# EAGLE board tf330 (EAGLE 9.5.2), part 1 of 2
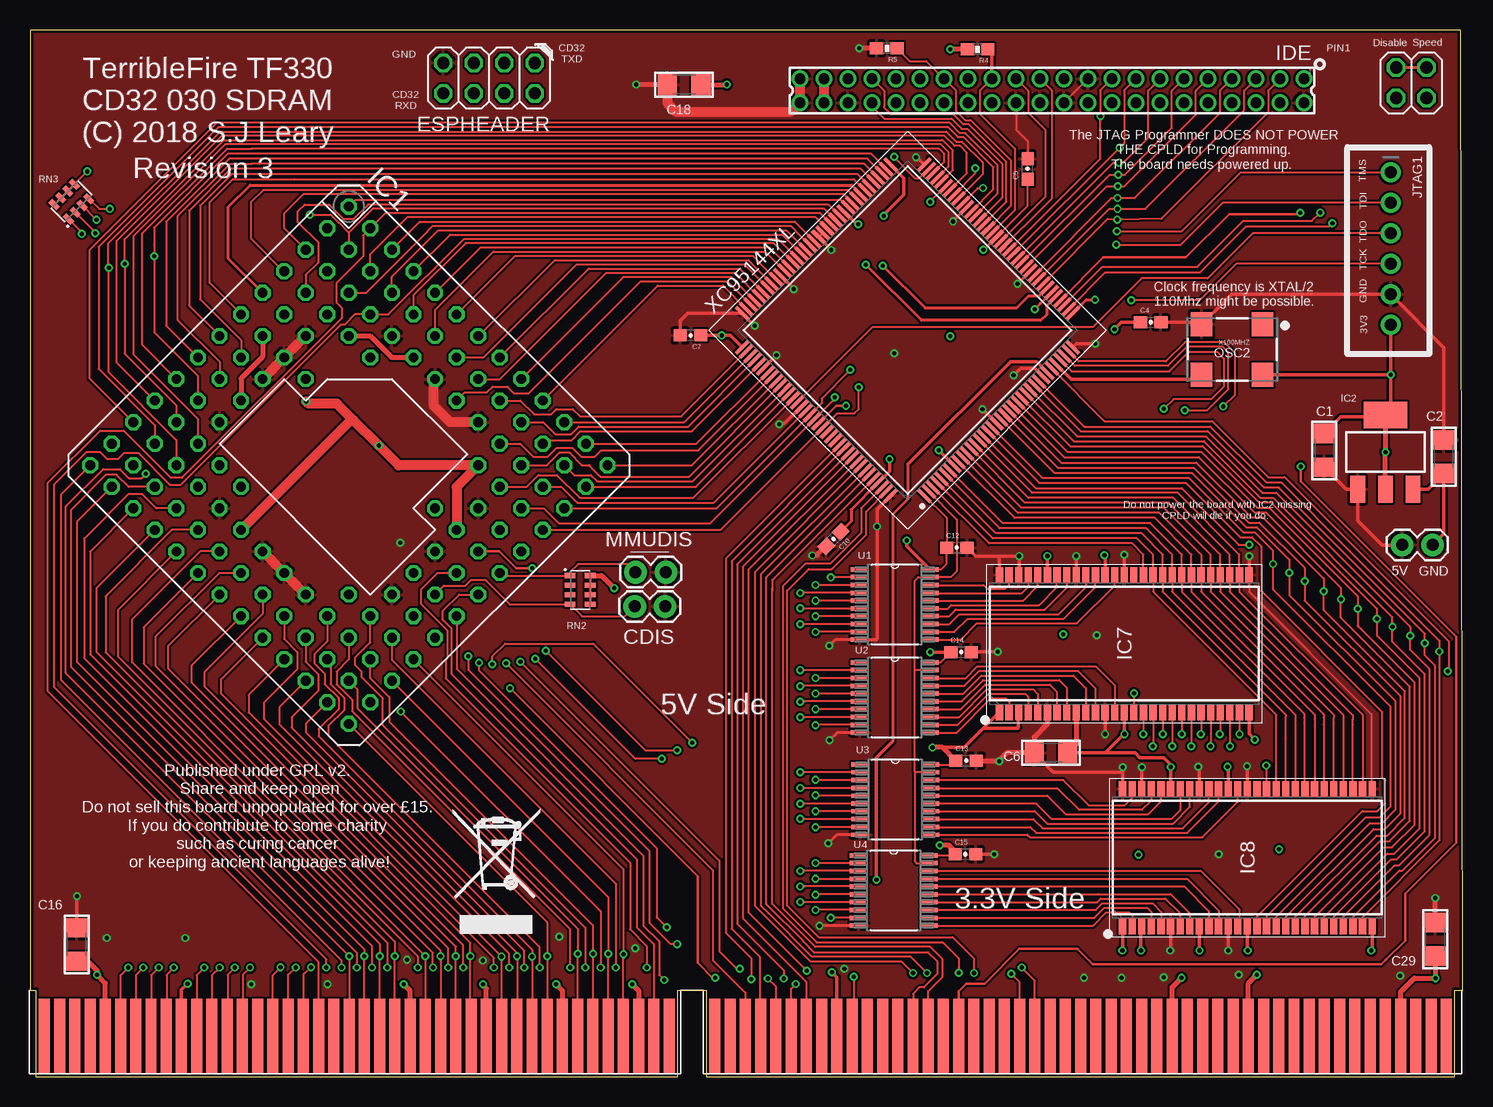
[diagram p4: board, top side]
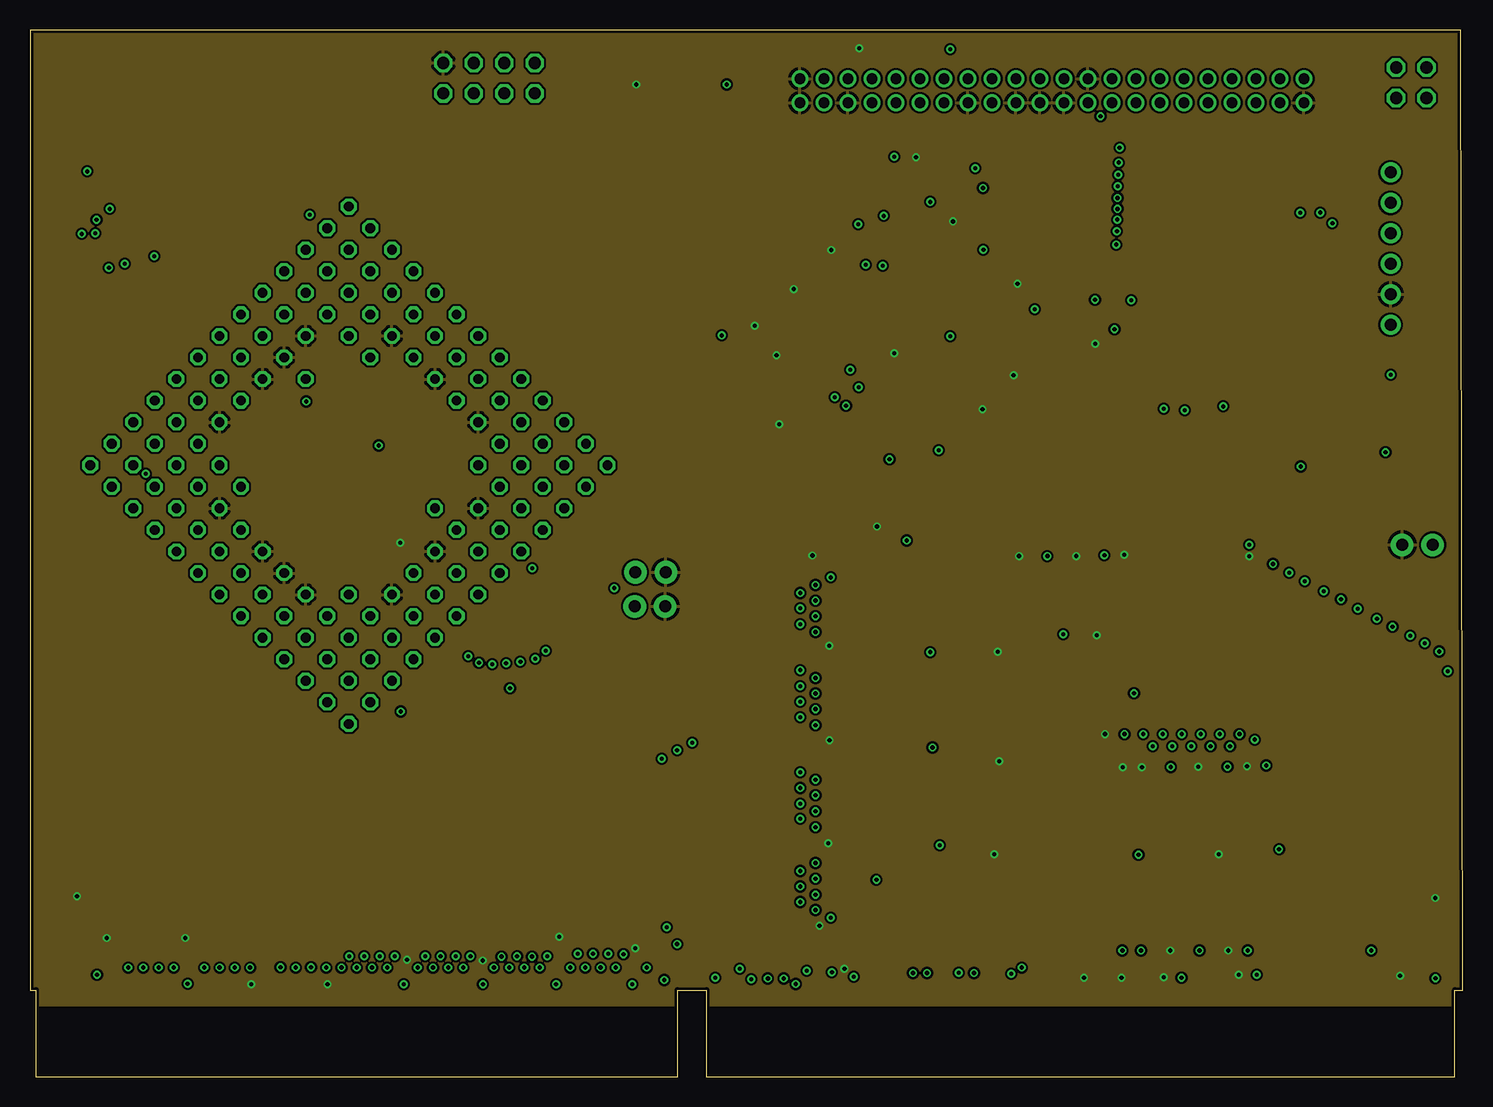
[diagram p5: board, inner layer GND]
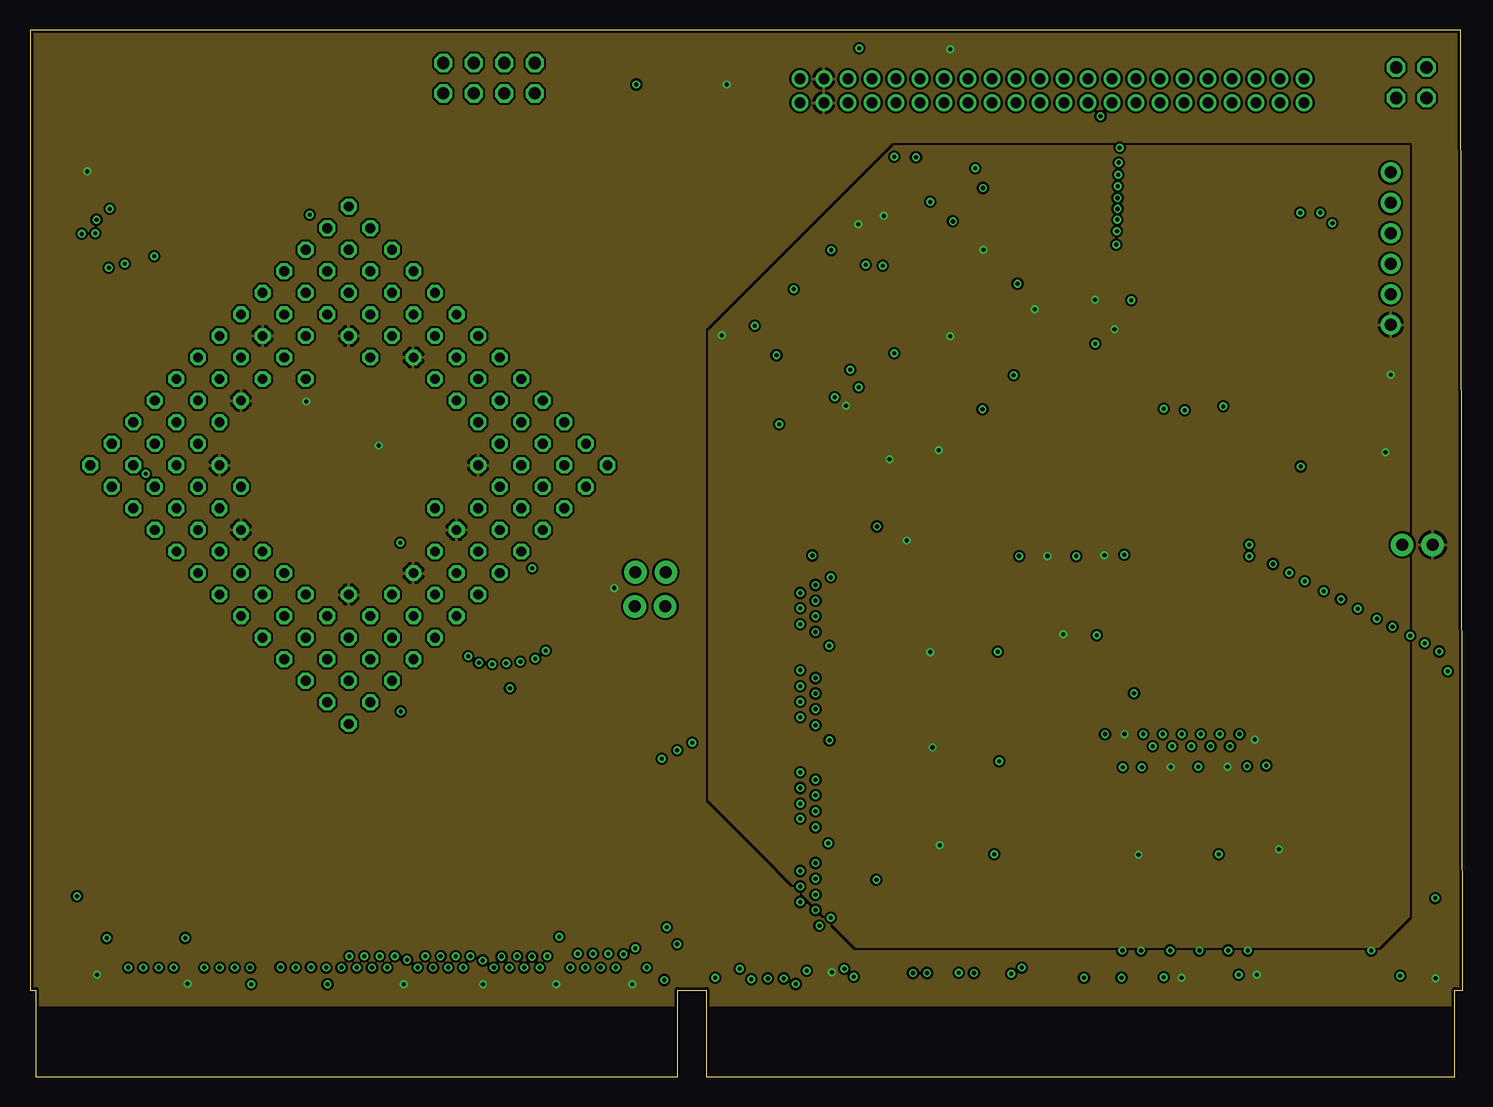
[diagram p6: board, inner layer PWR]
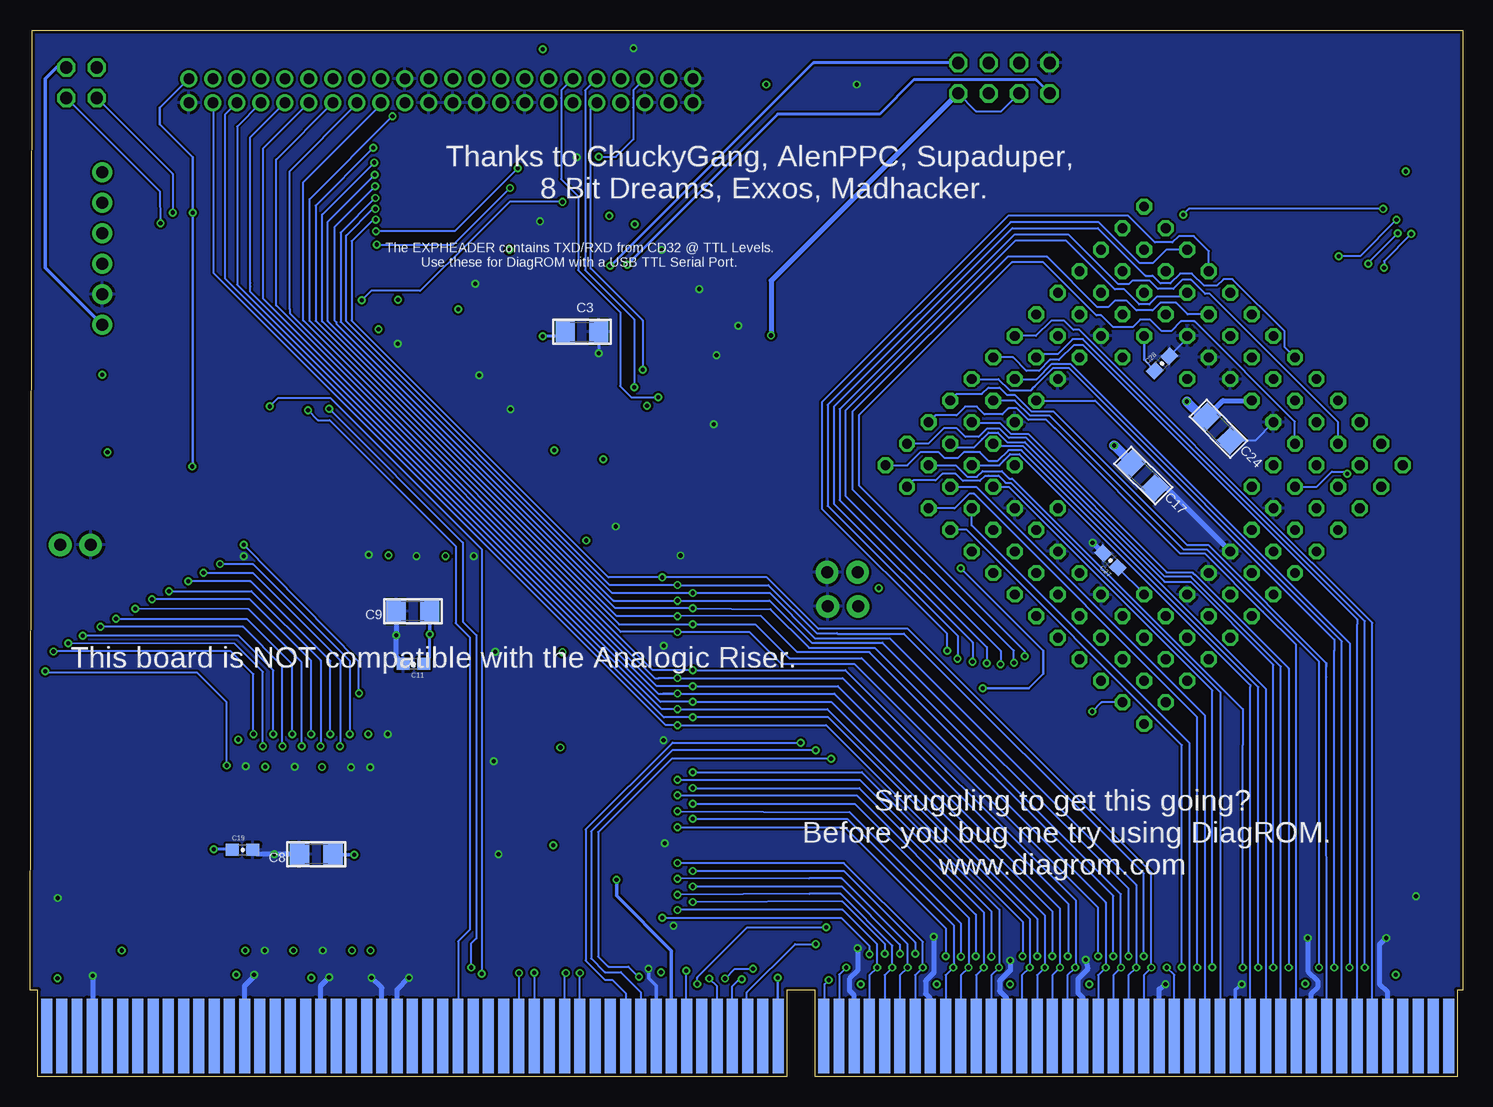
[diagram p7: board, bottom side, seen from below]

Size 119.41 x 87.22 mm. Coordinates in mm from the lower left corner, seen from the top.
Outline: 0.48,0 53.97,0 53.97,7.21 56.36,7.21 56.36,0 118.74,0 118.74,7.21 119.41,7.21 119.23,87.22 0,87.22 0,7.21 0.48,7.21 0.48,0
Copper layers (1*2*15*16): Top 0.035mm / dielectric 0.2mm / GND 0.0175mm / dielectric 1.2mm / PWR 0.0175mm / dielectric 0.2mm / Bottom 0.035mm
Design rules "dirtypcbs_4_layer *": minimum track width 5mil, minimum drill 12mil, track to track 7mil, track to pad 7mil, pad to pad 7mil, via to via 8mil, smd to smd 0mil, copper to edge 10mil, drill to drill 10mil, minimum pad ring 10mil, minimum via ring 6mil, stop-mask expansion 2mil, vias tented up to drill 25mil, thermal gap 10mil

## Footprints (pad centres in the part's own frame; a part is rotated, then mirrored left to right if it is on the bottom)
1X02 = drill 1.016 pad 1.88: 1 0,0; 2 2.54,0
1206 = smd 1.6 x 1.8: 1 -1.4,0; 2 1.4,0
0603-CAP = smd 1.1 x 1: 1 -0.85,0; 2 0.85,0
MCA_CONN_182 = smd 0.914 x 6.223 bottom: PIN1 -5.08,3.81; PIN3 -3.81,3.81; PIN5 -2.54,3.81; PIN7 -1.27,3.81; PIN9 0,3.81; PIN11 1.27,3.81; PIN13 2.54,3.81; PIN15 3.81,3.81; PIN17 5.08,3.81; PIN19 6.35,3.81; PIN21 7.62,3.81; PIN23 8.89,3.81; PIN25 10.16,3.81; PIN27 11.43,3.81; PIN29 12.7,3.81; PIN31 13.97,3.81; PIN33 15.24,3.81; PIN35 16.51,3.81; PIN37 17.78,3.81; PIN39 19.05,3.81; PIN41 20.32,3.81; PIN43 21.59,3.81; PIN45 22.86,3.81; PIN47 24.13,3.81; PIN49 25.4,3.81; PIN51 26.67,3.81; PIN53 27.94,3.81; PIN55 29.21,3.81; PIN57 30.48,3.81; PIN59 31.75,3.81; PIN61 33.02,3.81; PIN63 34.29,3.81; PIN65 35.56,3.81; PIN67 36.83,3.81; PIN69 38.1,3.81; PIN71 39.37,3.81; PIN73 40.64,3.81; PIN75 41.91,3.81; PIN77 43.18,3.81; PIN79 44.45,3.81; PIN81 45.72,3.81; PIN83 46.99,3.81; PIN85 50.8,3.81; PIN87 52.07,3.81; PIN89 53.34,3.81; PIN91 54.61,3.81; PIN93 55.88,3.81; PIN95 57.15,3.81; PIN97 58.42,3.81; PIN99 59.69,3.81; PIN101 60.96,3.81; PIN103 62.23,3.81; PIN105 63.5,3.81; PIN107 64.77,3.81; PIN109 66.04,3.81; PIN111 67.31,3.81; PIN113 68.58,3.81; PIN115 69.85,3.81; PIN117 71.12,3.81; PIN119 72.39,3.81; PIN121 73.66,3.81; PIN123 74.93,3.81; PIN125 76.2,3.81; PIN127 77.47,3.81; PIN129 78.74,3.81; PIN131 80.01,3.81; PIN133 81.28,3.81; PIN135 82.55,3.81; PIN137 83.82,3.81; PIN139 85.09,3.81; PIN141 86.36,3.81; PIN143 87.63,3.81; PIN145 88.9,3.81; PIN147 90.17,3.81; PIN149 91.44,3.81; PIN151 92.71,3.81; PIN153 93.98,3.81; PIN155 95.25,3.81; PIN157 96.52,3.81; PIN159 97.79,3.81; PIN161 99.06,3.81; PIN163 100.33,3.81; PIN165 101.6,3.81; PIN167 102.87,3.81; PIN169 104.14,3.81; PIN171 105.41,3.81; PIN173 106.68,3.81; PIN175 107.95,3.81; PIN177 109.22,3.81; PIN179 110.49,3.81; PIN181 111.76,3.81 | smd 0.914 x 6.223: PIN2 -5.08,3.81; PIN4 -3.81,3.81; PIN6 -2.54,3.81; PIN8 -1.27,3.81; PIN10 0,3.81; PIN12 1.27,3.81; PIN14 2.54,3.81; PIN16 3.81,3.81; PIN18 5.08,3.81; PIN20 6.35,3.81; PIN22 7.62,3.81; PIN24 8.89,3.81; PIN26 10.16,3.81; PIN28 11.43,3.81; PIN30 12.7,3.81; PIN32 13.97,3.81; PIN34 15.24,3.81; PIN36 16.51,3.81; PIN38 17.78,3.81; PIN40 19.05,3.81; PIN42 20.32,3.81; PIN44 21.59,3.81; PIN46 22.86,3.81; PIN48 24.13,3.81; PIN50 25.4,3.81; PIN52 26.67,3.81; PIN54 27.94,3.81; PIN56 29.21,3.81; PIN58 30.48,3.81; PIN60 31.75,3.81; PIN62 33.02,3.81; PIN64 34.29,3.81; PIN66 35.56,3.81; PIN68 36.83,3.81; PIN70 38.1,3.81; PIN72 39.37,3.81; PIN74 40.64,3.81; PIN76 41.91,3.81; PIN78 43.18,3.81; PIN80 44.45,3.81; PIN82 45.72,3.81; PIN84 46.99,3.81; PIN86 50.8,3.81; PIN88 52.07,3.81; PIN90 53.34,3.81; PIN92 54.61,3.81; PIN94 55.88,3.81; PIN96 57.15,3.81; PIN98 58.42,3.81; PIN100 59.69,3.81; PIN102 60.96,3.81; PIN104 62.23,3.81; PIN106 63.5,3.81; PIN108 64.77,3.81; PIN110 66.04,3.81; PIN112 67.31,3.81; PIN114 68.58,3.81; PIN116 69.85,3.81; PIN118 71.12,3.81; PIN120 72.39,3.81; PIN122 73.66,3.81; PIN124 74.93,3.81; PIN126 76.2,3.81; PIN128 77.47,3.81; PIN130 78.74,3.81; PIN132 80.01,3.81; PIN134 81.28,3.81; PIN136 82.55,3.81; PIN138 83.82,3.81; PIN140 85.09,3.81; PIN142 86.36,3.81; PIN144 87.63,3.81; PIN146 88.9,3.81; PIN148 90.17,3.81; PIN150 91.44,3.81; PIN152 92.71,3.81; PIN154 93.98,3.81; PIN156 95.25,3.81; PIN158 96.52,3.81; PIN160 97.79,3.81; PIN162 99.06,3.81; PIN164 100.33,3.81; PIN166 101.6,3.81; PIN168 102.87,3.81; PIN170 104.14,3.81; PIN172 105.41,3.81; PIN174 106.68,3.81; PIN176 107.95,3.81; PIN178 109.22,3.81; PIN180 110.49,3.81; PIN182 111.76,3.81
2X04 = drill 1.016 octagon: 1 -3.81,-1.27; 2 -3.81,1.27; 3 -1.27,-1.27; 4 -1.27,1.27; 5 1.27,-1.27; 6 1.27,1.27; 7 3.81,-1.27; 8 3.81,1.27
MPGA128 = drill 0.813 octagon: A01 -15.24,15.24; A02 -12.7,15.24; A03 -10.16,15.24; A04 -7.62,15.24; A05 -5.08,15.24; A06 -2.54,15.24; A07 0,15.24; A08 2.54,15.24; A09 5.08,15.24; A10 7.62,15.24; A11 10.16,15.24; A12 12.7,15.24; A13 15.24,15.24; B01 -15.24,12.7; B02 -12.7,12.7; B03 -10.16,12.7; B04 -7.62,12.7; B05 -5.08,12.7; B06 -2.54,12.7; B07 0,12.7; B08 2.54,12.7; B09 5.08,12.7; B10 7.62,12.7; B11 10.16,12.7; B12 12.7,12.7; B13 15.24,12.7; C01 -15.24,10.16; C02 -12.7,10.16; C03 -10.16,10.16; C04 -7.62,10.16; C05 -5.08,10.16; C06 -2.54,10.16; C07 0,10.16; C08 2.54,10.16; C09 5.08,10.16; C10 7.62,10.16; C11 10.16,10.16; C12 12.7,10.16; C13 15.24,10.16; D01 -15.24,7.62; D02 -12.7,7.62; D03 -10.16,7.62; D04 -7.62,7.62; D05 -5.08,7.62; D10 7.62,7.62; D11 10.16,7.62; D12 12.7,7.62; D13 15.24,7.62; E01 -15.24,5.08; E02 -12.7,5.08; E03 -10.16,5.08; E11 10.16,5.08; E12 12.7,5.08; E13 15.24,5.08; F01 -15.24,2.54; F02 -12.7,2.54; F03 -10.16,2.54; F04 -7.62,2.54; F10 7.62,2.54; F11 10.16,2.54; F12 12.7,2.54; F13 15.24,2.54; G01 -15.24,0; G02 -12.7,0; G03 -10.16,0; G11 10.16,0; G12 12.7,0; G13 15.24,0; H01 -15.24,-2.54; H02 -12.7,-2.54; H03 -10.16,-2.54; H11 10.16,-2.54; H12 12.7,-2.54; H13 15.24,-2.54; J01 -15.24,-5.08; J02 -12.7,-5.08; J03 -10.16,-5.08; J11 10.16,-5.08; J12 12.7,-5.08; J13 15.24,-5.08; K01 -15.24,-7.62; K02 -12.7,-7.62; K03 -10.16,-7.62; K04 -7.62,-7.62; K05 -5.08,-7.62; K10 7.62,-7.62; K11 10.16,-7.62; K12 12.7,-7.62; K13 15.24,-7.62; L01 -15.24,-10.16; L02 -12.7,-10.16; L03 -10.16,-10.16; L04 -7.62,-10.16; L05 -5.08,-10.16; L06 -2.54,-10.16; L07 0,-10.16; L08 2.54,-10.16; L09 5.08,-10.16; L10 7.62,-10.16; L11 10.16,-10.16; L12 12.7,-10.16; L13 15.24,-10.16; M01 -15.24,-12.7; M02 -12.7,-12.7; M03 -10.16,-12.7; M04 -7.62,-12.7; M05 -5.08,-12.7; M06 -2.54,-12.7; M07 0,-12.7; M08 2.54,-12.7; M09 5.08,-12.7; M10 7.62,-12.7; M11 10.16,-12.7; M12 12.7,-12.7; M13 15.24,-12.7; N01 -15.24,-15.24; N02 -12.7,-15.24; N03 -10.16,-15.24; N04 -7.62,-15.24; N05 -5.08,-15.24; N06 -2.54,-15.24; N07 0,-15.24; N08 2.54,-15.24; N09 5.08,-15.24; N10 7.62,-15.24; N11 10.16,-15.24; N12 12.7,-15.24; N13 15.24,-15.24
SOT223 = smd 1.219 x 2.235: 1 -2.311,-3.099; 2 0,-3.099; 3 2.311,-3.099 | smd 3.6 x 2.2: 4 0,3.099
SOP80P1176X120-54N = smd 1.295 x 0.6: 1 -5.728,10.4; 2 -5.728,9.6; 3 -5.728,8.8; 4 -5.728,8; 5 -5.728,7.2; 6 -5.728,6.4; 7 -5.728,5.6; 8 -5.728,4.8; 9 -5.728,4; 10 -5.728,3.2; 11 -5.728,2.4; 12 -5.728,1.6; 13 -5.728,0.8; 14 -5.728,0; 15 -5.728,-0.8; 16 -5.728,-1.6; 17 -5.728,-2.4; 18 -5.728,-3.2; 19 -5.728,-4; 20 -5.728,-4.8; 21 -5.728,-5.6; 22 -5.728,-6.4; 23 -5.728,-7.2; 24 -5.728,-8; 25 -5.728,-8.8; 26 -5.728,-9.6; 27 -5.728,-10.4; 28 5.728,-10.4; 29 5.728,-9.6; 30 5.728,-8.8; 31 5.728,-8; 32 5.728,-7.2; 33 5.728,-6.4; 34 5.728,-5.6; 35 5.728,-4.8; 36 5.728,-4; 37 5.728,-3.2; 38 5.728,-2.4; 39 5.728,-1.6; 40 5.728,-0.8; 41 5.728,0; 42 5.728,0.8; 43 5.728,1.6; 44 5.728,2.4; 45 5.728,3.2; 46 5.728,4; 47 5.728,4.8; 48 5.728,5.6; 49 5.728,6.4; 50 5.728,7.2; 51 5.728,8; 52 5.728,8.8; 53 5.728,9.6; 54 5.728,10.4
87758-4416 = drill 0.9 pad 1.27: 1 -21,-1; 2 -21,1; 3 -19,-1; 4 -19,1; 5 -17,-1; 6 -17,1; 7 -15,-1; 8 -15,1; 9 -13,-1; 10 -13,1; 11 -11,-1; 12 -11,1; 13 -9,-1; 14 -9,1; 15 -7,-1; 16 -7,1; 17 -5,-1; 18 -5,1; 19 -3,-1; 20 -3,1; 21 -1,-1; 22 -1,1; 23 1,-1; 24 1,1; 25 3,-1; 26 3,1; 27 5,-1; 28 5,1; 29 7,-1; 30 7,1; 31 9,-1; 32 9,1; 33 11,-1; 34 11,1; 35 13,-1; 36 13,1; 37 15,-1; 38 15,1; 39 17,-1; 40 17,1; 41 19,-1; 42 19,1; 43 21,-1; 44 21,1
2X02 = drill 1.016 octagon: 1 -1.27,-1.27; 2 -1.27,1.27; 3 1.27,-1.27; 4 1.27,1.27
1X06_ROUND = drill 1 pad 1.676: 1 -6.35,0; 2 -3.81,0; 3 -1.27,0; 4 1.27,0; 5 3.81,0; 6 6.35,0
OSC_7X5MM = smd 1.8 x 2: 1 -2.54,-2.1; 2 2.54,-2.1; 3 2.54,2.1; 4 -2.54,2.1
0603 = smd 1.1 x 1: 1 -0.85,0; 2 0.85,0
RESCAXE80P320X160-8N = smd 0.9 x 0.425: 1 -0.85,1.2; 2 -0.85,0.4; 3 -0.85,-0.4; 4 -0.85,-1.2; 5 0.85,-1.2; 6 0.85,-0.4; 7 0.85,0.4; 8 0.85,1.2
SOP65P640X120-20N = smd 1.473 x 0.356: 1 -2.921,2.921; 2 -2.921,2.286; 3 -2.921,1.626; 4 -2.921,0.965; 5 -2.921,0.33; 6 -2.921,-0.33; 7 -2.921,-0.965; 8 -2.921,-1.626; 9 -2.921,-2.286; 10 -2.921,-2.921; 11 2.921,-2.921; 12 2.921,-2.286; 13 2.921,-1.626; 14 2.921,-0.965; 15 2.921,-0.33; 16 2.921,0.33; 17 2.921,0.965; 18 2.921,1.626; 19 2.921,2.286; 20 2.921,2.921
SAMACSYS_PARTS_QFP50P2200X2200X160-144N = smd 1.475 x 0.3: 1 -10.738,8.75; 2 -10.738,8.25; 3 -10.738,7.75; 4 -10.738,7.25; 5 -10.738,6.75; 6 -10.738,6.25; 7 -10.738,5.75; 8 -10.738,5.25; 9 -10.738,4.75; 10 -10.738,4.25; 11 -10.738,3.75; 12 -10.738,3.25; 13 -10.738,2.75; 14 -10.738,2.25; 15 -10.738,1.75; 16 -10.738,1.25; 17 -10.738,0.75; 18 -10.738,0.25; 19 -10.738,-0.25; 20 -10.738,-0.75; 21 -10.738,-1.25; 22 -10.738,-1.75; 23 -10.738,-2.25; 24 -10.738,-2.75; 25 -10.738,-3.25; 26 -10.738,-3.75; 27 -10.738,-4.25; 28 -10.738,-4.75; 29 -10.738,-5.25; 30 -10.738,-5.75; 31 -10.738,-6.25; 32 -10.738,-6.75; 33 -10.738,-7.25; 34 -10.738,-7.75; 35 -10.738,-8.25; 36 -10.738,-8.75; 73 10.738,-8.75; 74 10.738,-8.25; 75 10.738,-7.75; 76 10.738,-7.25; 77 10.738,-6.75; 78 10.738,-6.25; 79 10.738,-5.75; 80 10.738,-5.25; 81 10.738,-4.75; 82 10.738,-4.25; 83 10.738,-3.75; 84 10.738,-3.25; 85 10.738,-2.75; 86 10.738,-2.25; 87 10.738,-1.75; 88 10.738,-1.25; 89 10.738,-0.75; 90 10.738,-0.25; 91 10.738,0.25; 92 10.738,0.75; 93 10.738,1.25; 94 10.738,1.75; 95 10.738,2.25; 96 10.738,2.75; 97 10.738,3.25; 98 10.738,3.75; 99 10.738,4.25; 100 10.738,4.75; 101 10.738,5.25; 102 10.738,5.75; 103 10.738,6.25; 104 10.738,6.75; 105 10.738,7.25; 106 10.738,7.75; 107 10.738,8.25; 108 10.738,8.75 | smd 0.3 x 1.475: 37 -8.75,-10.738; 38 -8.25,-10.738; 39 -7.75,-10.738; 40 -7.25,-10.738; 41 -6.75,-10.738; 42 -6.25,-10.738; 43 -5.75,-10.738; 44 -5.25,-10.738; 45 -4.75,-10.738; 46 -4.25,-10.738; 47 -3.75,-10.738; 48 -3.25,-10.738; 49 -2.75,-10.738; 50 -2.25,-10.738; 51 -1.75,-10.738; 52 -1.25,-10.738; 53 -0.75,-10.738; 54 -0.25,-10.738; 55 0.25,-10.738; 56 0.75,-10.738; 57 1.25,-10.738; 58 1.75,-10.738; 59 2.25,-10.738; 60 2.75,-10.738; 61 3.25,-10.738; 62 3.75,-10.738; 63 4.25,-10.738; 64 4.75,-10.738; 65 5.25,-10.738; 66 5.75,-10.738; 67 6.25,-10.738; 68 6.75,-10.738; 69 7.25,-10.738; 70 7.75,-10.738; 71 8.25,-10.738; 72 8.75,-10.738; 109 8.75,10.738; 110 8.25,10.738; 111 7.75,10.738; 112 7.25,10.738; 113 6.75,10.738; 114 6.25,10.738; 115 5.75,10.738; 116 5.25,10.738; 117 4.75,10.738; 118 4.25,10.738; 119 3.75,10.738; 120 3.25,10.738; 121 2.75,10.738; 122 2.25,10.738; 123 1.75,10.738; 124 1.25,10.738; 125 0.75,10.738; 126 0.25,10.738; 127 -0.25,10.738; 128 -0.75,10.738; 129 -1.25,10.738; 130 -1.75,10.738; 131 -2.25,10.738; 132 -2.75,10.738; 133 -3.25,10.738; 134 -3.75,10.738; 135 -4.25,10.738; 136 -4.75,10.738; 137 -5.25,10.738; 138 -5.75,10.738; 139 -6.25,10.738; 140 -6.75,10.738; 141 -7.25,10.738; 142 -7.75,10.738; 143 -8.25,10.738; 144 -8.75,10.738

## Placement (x,y rotation side)
5VPWR  EXT5V  [1X02]  114.35,44.32 0 top
C1  10uF  [1206]  107.85,52.2 270 top
C2  10uF  [1206]  117.83,51.66 90 top
C3  10uF  [1206]  73.41,62.08 0 bottom
C4  0.1uF  [0603-CAP]  93.4,62.87 0 top
C5  0.1uF  [0603-CAP]  83.13,75.64 90 top
C6  10uF  [1206]  85.09,26.97 180 top
C7  0.1uF  [0603-CAP]  55.04,61.77 180 top
C8  10uF  [1206]  95.55,18.54 180 bottom
C9  10uF  [1206]  87.5,38.79 180 bottom
C10  0.1uF  [0603-CAP]  66.95,44.81 225 top
C11  0.1uF  [0603-CAP]  87.45,34.39 180 bottom
C12  0.1uF  [0603-CAP]  77.24,44.09 0 top
C13  0.1uF  [0603-CAP]  78,26.34 0 top
C14  0.1uF  [0603-CAP]  77.6,35.38 0 top
C15  0.1uF  [0603-CAP]  77.95,18.54 0 top
C16  22uF  [1206]  3.89,11.02 90 top
C17  10uF  [1206]  26.64,50.09 315 bottom
C18  10uF  [1206]  54.51,82.68 180 top
C19  0.1uF  [0603-CAP]  101.7,18.9 0 bottom
C24  10uF  [1206]  20.37,54 315 bottom
C27  0.1uF  [0603-CAP]  29.36,43.03 135 bottom
C28  0.1uF  [0603-CAP]  25.07,59.44 45 bottom
C29  22uF  [1206]  117.09,11.46 90 top
CDIS  CDIS  [1X02]  52.93,39.19 180 top
CONN1  MCA_CONN_182  [MCA_CONN_182]  6.27,-0.41 0 top
ESPHEADER  [2X04]  38.25,83.21 180 top
IC1  MC68030  [MPGA128]  26.57,50.95 315 top
IC2  LM1117-3.3  [SOT223]  112.95,52.04 0 top
IC7  MT48LC16M16A2P-6A_G  [SOP80P1176X120-54N]  91.19,36.09 90 top
IC8  MT48LC16M16A2P-6A_G  [SOP80P1176X120-54N]  101.45,18.26 90 top
IDE  87758-4416  [87758-4416]  85.17,82.17 180 top
JP1  [2X02]  115.11,82.83 0 top
JTAG1  JTAG  [1X06_ROUND]  113.39,69.01 270 top
MMUDIS  MMUDIS  [1X02]  52.98,42.04 180 top
OSC2  X100MHZ  [OSC_7X5MM]  100.18,60.6 180 top
R4  1K  [0603]  78.97,85.62 180 top
R5  1K  [0603]  71.4,85.7 180 top
RN2  CAY16-103J4LF  [RESCAXE80P320X160-8N]  45.85,40.56 0 top
RN3  CAY16-103J4LF  [RESCAXE80P320X160-8N]  3.45,72.92 135 top
U1  SN74CB3T3245PW  [SOP65P640X120-20N]  72.06,39.34 0 top
U2  SN74CB3T3245PW  [SOP65P640X120-20N]  72.06,31.6 0 top
U3  SN74CB3T3245PW  [SOP65P640X120-20N]  72.11,23.09 0 top
U4  SN74CB3T3245PW  [SOP65P640X120-20N]  71.98,15.52 0 top
XC95144XL  SAMACSYS_PARTS_XC95144XL-10TQG144I  [SAMACSYS_PARTS_QFP50P2200X2200X160-144N]  73.13,62.2 135 top